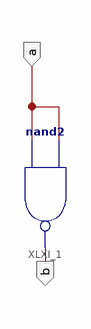
[diagram p0: schematic sheet 1]
// Xilinx ISE schematic Not.sch (xc9500xl) as structural Verilog: 1 symbols, 2 ports
module Not (
  input  a,
  output b
);

  nand XLXI_1 (b, a, a);
endmodule
